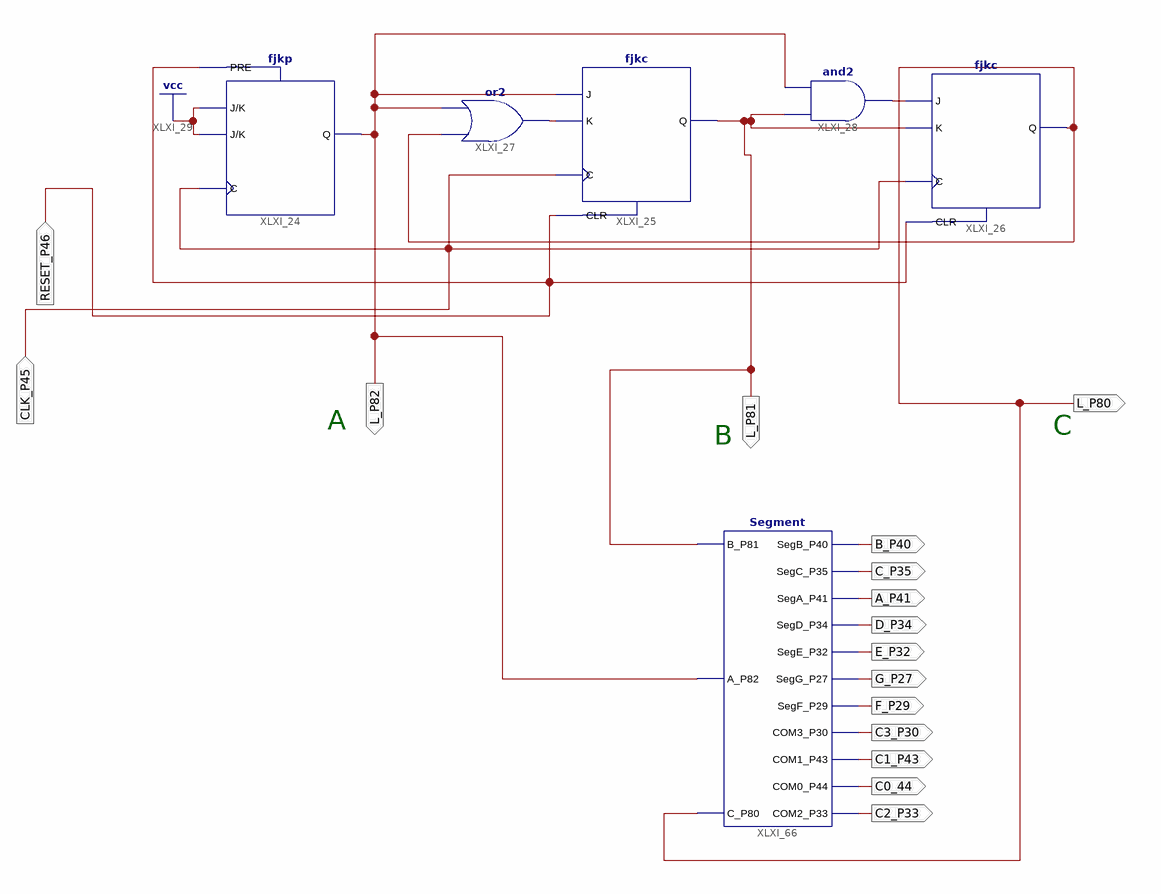
[diagram p0: schematic sheet 1]
// Xilinx ISE schematic Counter.sch (spartan6) as structural Verilog: 6 symbols, 16 ports
module Counter (
  input  CLK_P45,
  input  RESET_P46,
  output L_P82,
  output L_P80,
  output L_P81,
  output B_P40,
  output C_P35,
  output A_P41,
  output D_P34,
  output E_P32,
  output G_P27,
  output F_P29,
  output C3_P30,
  output C1_P43,
  output C0_44,
  output C2_P33
);

  wire XLXN_6, XLXN_7;

  and XLXI_28 (XLXN_7, L_P81, L_P82);
  fjkc XLXI_26 (.C(CLK_P45), .CLR(RESET_P46), .J(XLXN_7), .K(L_P81), .Q(L_P80));
  fjkc XLXI_25 (.C(CLK_P45), .CLR(RESET_P46), .J(L_P82), .K(XLXN_6), .Q(L_P81));
  or XLXI_27 (XLXN_6, L_P80, L_P82);
  fjkp XLXI_24 (.C(CLK_P45), .J(1'b1), .K(1'b1), .PRE(RESET_P46), .Q(L_P82));
  Segment XLXI_66 (
    .B_P81(L_P81), .A_P82(L_P82), .C_P80(L_P80), .SegB_P40(B_P40), .SegC_P35(C_P35), .SegA_P41(A_P41),
    .SegD_P34(D_P34), .SegE_P32(E_P32), .SegG_P27(G_P27), .SegF_P29(F_P29), .COM3_P30(C3_P30),
    .COM1_P43(C1_P43), .COM0_P44(C0_44), .COM2_P33(C2_P33));

  // Notes on the sheet:
  //   A
  //   C
  //   B
  //   CLOCK_DEDICATED_ROUTE on signal CLK_P45 = TRUE
endmodule
